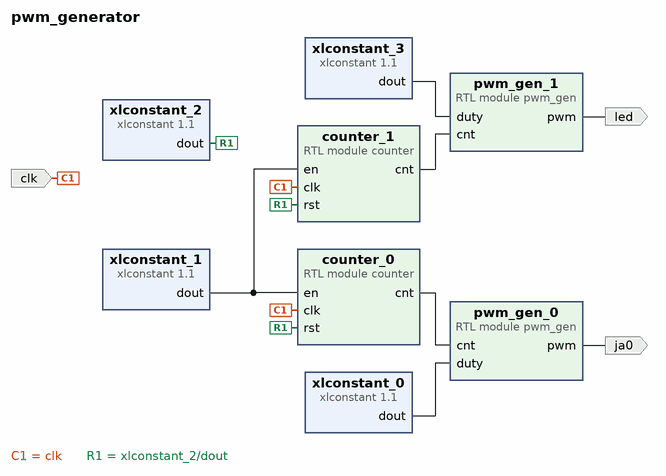
[diagram p0: block diagram of the top level]
# Vivado block design pwm_generator, xc7z020clg400-1, Vivado 2023.2
create_bd_design pwm_generator

create_bd_port -dir O ja0
create_bd_port -dir I -type clk clk
set_property -dict {CONFIG.CLK_DOMAIN pwm_generator_clk_0 CONFIG.FREQ_HZ 125000000} [get_bd_ports clk]
create_bd_port -dir O led

create_bd_cell -type module -reference counter counter_0
set_property -dict {CONFIG.n_bits 21} [get_bd_cells counter_0]
create_bd_cell -type module -reference pwm_gen pwm_gen_0
set_property -dict {CONFIG.n_bits 21} [get_bd_cells pwm_gen_0]
create_bd_cell -type ip -vlnv xilinx.com:ip:xlconstant:1.1 xlconstant_0
set_property -dict {CONFIG.CONST_VAL 612500 CONFIG.CONST_WIDTH 21} [get_bd_cells xlconstant_0]
create_bd_cell -type ip -vlnv xilinx.com:ip:xlconstant:1.1 xlconstant_1
create_bd_cell -type ip -vlnv xilinx.com:ip:xlconstant:1.1 xlconstant_2
set_property -dict {CONFIG.CONST_VAL 0} [get_bd_cells xlconstant_2]
create_bd_cell -type module -reference counter counter_1
set_property -dict {CONFIG.n_bits 27} [get_bd_cells counter_1]
create_bd_cell -type module -reference pwm_gen pwm_gen_1
set_property -dict {CONFIG.n_bits 27} [get_bd_cells pwm_gen_1]
create_bd_cell -type ip -vlnv xilinx.com:ip:xlconstant:1.1 xlconstant_3
set_property -dict {CONFIG.CONST_VAL 67108864 CONFIG.CONST_WIDTH 27} [get_bd_cells xlconstant_3]

# ---- connections ----

connect_bd_net [get_bd_pins counter_0/cnt] [get_bd_pins pwm_gen_0/cnt]
connect_bd_net [get_bd_pins counter_1/cnt] [get_bd_pins pwm_gen_1/cnt]
connect_bd_net [get_bd_pins pwm_gen_0/pwm] [get_bd_ports ja0]
connect_bd_net [get_bd_pins pwm_gen_1/pwm] [get_bd_ports led]
connect_bd_net -net sysclk_1 [get_bd_ports clk] [get_bd_pins counter_0/clk] [get_bd_pins counter_1/clk]
connect_bd_net [get_bd_pins xlconstant_0/dout] [get_bd_pins pwm_gen_0/duty]
connect_bd_net [get_bd_pins xlconstant_1/dout] [get_bd_pins counter_0/en] [get_bd_pins counter_1/en]
connect_bd_net [get_bd_pins xlconstant_2/dout] [get_bd_pins counter_0/rst] [get_bd_pins counter_1/rst]
connect_bd_net [get_bd_pins xlconstant_3/dout] [get_bd_pins pwm_gen_1/duty]

validate_bd_design
save_bd_design
